# Altium schematic sheet Connections.SchDoc
size A4
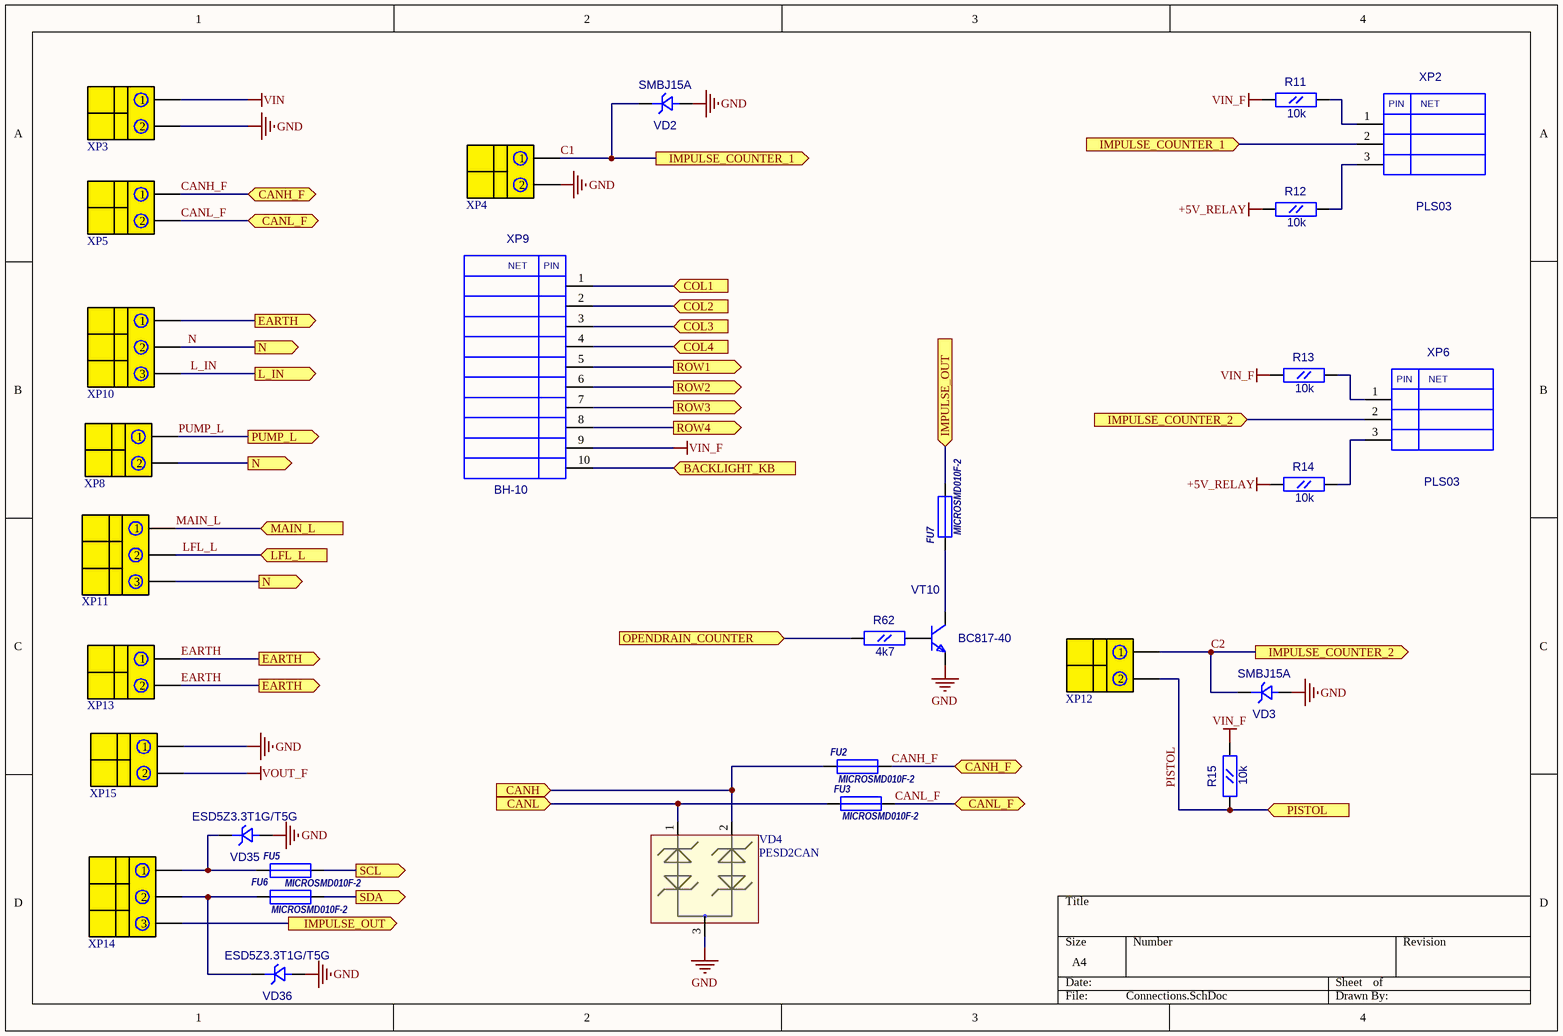
[diagram p0: Connections.SchDoc]

## Parts
FU2  MICROSMD010F-2  [RC1210]
FU3  MICROSMD010F-2  [RC1210]
FU5  MICROSMD010F-2  [RC1210]
FU6  MICROSMD010F-2  [RC1210]
FU7  MICROSMD010F-2  [RC1210]
R11  10k  [RC0603]
R12  10k  [RC0603]
R13  10k  [RC0603]
R14  10k  [RC0603]
R15  10k  [RC0603]
R62  4k7  [RC0603]
VD2  SMBJ15A  [SMB]
VD3  SMBJ15A  [SMB]
VD4  PESD2CAN  [SOT-23(123)]
VD35  ESD5Z3.3T1G/T5G  [SOD-523]
VD36  ESD5Z3.3T1G/T5G  [SOD-523]
VT10  BC817-40  [SOT-23(123)]
XP2  PLS03  [PLS-03]
XP3  DG330-2PIN  [DG330-2PIN]  (value not drawn)
XP4  DG330-2PIN  [DG330-2PIN]  (value not drawn)
XP5  DG330-2PIN  [DG330-2PIN]  (value not drawn)
XP6  PLS03  [PLS-03]
XP8  DG330-2PIN  [DG330-2PIN]  (value not drawn)
XP9  BH-10  [BH-10]
XP10  DG330-3PIN  [DG330-3PIN]  (value not drawn)
XP11  DG330-3PIN  [DG330-3PIN]  (value not drawn)
XP12  DG330-2PIN  [DG330-2PIN]  (value not drawn)
XP13  DG330-2PIN  [DG330-2PIN]  (value not drawn)
XP14  DG330-3PIN  [DG330-3PIN]  (value not drawn)
XP15  DG330-2PIN  [DG330-2PIN]  (value not drawn)

## Ports
BACKLIGHT_KB (in), CANH (in), CANH_F, CANL (in), CANL_F, COL1 (in), COL2 (in), COL3 (in), COL4 (in), EARTH (out), IMPULSE_COUNTER_1 (in), IMPULSE_COUNTER_1 (out), IMPULSE_COUNTER_2 (in), IMPULSE_COUNTER_2 (out), IMPULSE_OUT (in), IMPULSE_OUT (out), L_IN (out), LFL_L (in), MAIN_L (in), N (out), OPENDRAIN_COUNTER (in), PISTOL (in), PUMP_L (out), ROW1 (out), ROW2 (out), ROW3 (out), ROW4 (out), SCL (out), SDA (out)

## Nets
+5V_RELAY: R12.1(A) R14.1(A)
GND: VD2.1(A) VD3.1(A) VD4.3 VD35.1(A) VD36.1(A) VT10.2(E) XP3.2 XP4.2 XP15.1
VIN: XP3.1
VIN_F: R11.1(A) R13.1(A) R15.2(B) XP9.9
VOUT_F: XP15.2
BACKLIGHT_KB: XP9.10 ; port BACKLIGHT_KB
C1: VD2.2(K) XP2.2 XP4.1 ; port IMPULSE_COUNTER_1
C2: VD3.2(K) XP6.2 XP12.1 ; port IMPULSE_COUNTER_2
CANH: FU2.1 VD4.2 ; port CANH
CANH_F: FU2.2 XP5.1 ; port CANH_F
CANL: FU3.1 VD4.1 ; port CANL
CANL_F: FU3.2 XP5.2 ; port CANL_F
COL1: XP9.1 ; port COL1
COL2: XP9.2 ; port COL2
COL3: XP9.3 ; port COL3
COL4: XP9.4 ; port COL4
EARTH: XP10.1 XP13.1 XP13.2 ; port EARTH
IMPULSE_OUT: FU7.2 XP14.3 ; port IMPULSE_OUT
L_IN: XP10.3 ; port L_IN
LFL_L: XP11.2 ; port LFL_L
MAIN_L: XP11.1 ; port MAIN_L
N: XP8.2 XP10.2 XP11.3 ; port N
OPENDRAIN_COUNTER: R62.1(A) ; port OPENDRAIN_COUNTER
PISTOL: R15.1(A) XP12.2 ; port PISTOL
PUMP_L: XP8.1 ; port PUMP_L
ROW1: XP9.5 ; port ROW1
ROW2: XP9.6 ; port ROW2
ROW3: XP9.7 ; port ROW3
ROW4: XP9.8 ; port ROW4
SCL: FU5.2 ; port SCL
SDA: FU6.2 ; port SDA
NetFU5_1: FU5.1 VD35.2(K) XP14.1
NetFU6_1: FU6.1 VD36.2(K) XP14.2
NetFU7_1: FU7.1 VT10.3(C)
NetR11_2: R11.2(B) XP2.1
NetR12_2: R12.2(B) XP2.3
NetR13_2: R13.2(B) XP6.1
NetR14_2: R14.2(B) XP6.3
NetR62_2: R62.2(B) VT10.1(B)

## Notes on the sheet
- (in symbol BH-10) NET; PIN
- (in symbol PLS03) PIN; NET

## Library data of the parts
FU2 FU3 FU5-FU7 = MICROSMD
  FU2 FU3 FU5 FU6: Value: MICROSMD010F-2
  FU7: Value: *
R11-R15 R62 = RC0603
  R11-R15: Value: 10k
  R62: Value: 4k7
VD2 VD3 = SMBJ: Value: SMBJ15A
VD4 = PESD2CAN: TVS for CAN
VD35 VD36 = ESD5Z: Supressor; Value: ESD5Z3.3T1G/T5G
VT10 = BC846BLT1: NPN 500ma transistor; ComponentField7: Published 29-Sep-2000; OriginalName: BC846BLT1; Value: BC817-40
XP2 XP6 = PLS03: Value: *
XP3-XP5 XP8 XP12 XP13 XP15 = DG330-2PIN: Value: DG330-2PIN
XP9 = BH-10: Value: *
XP10 XP11 XP14 = DG330-3PIN: Value: DG330-3PIN